# EAGLE schematic flipdot (EAGLE 7.7.0)
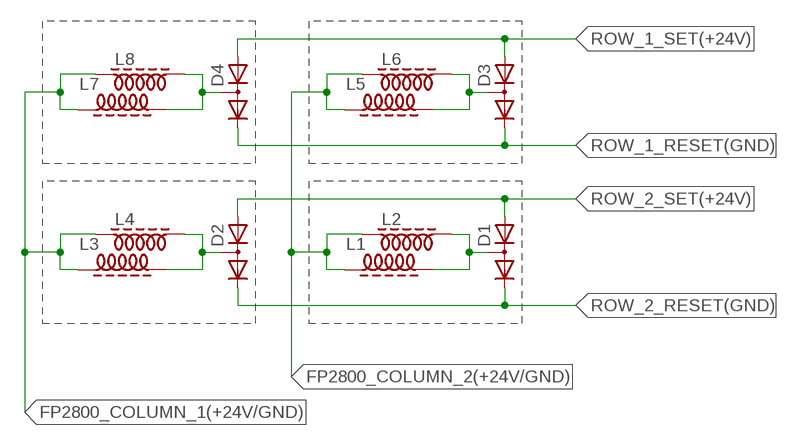
[diagram p0: schematic, sheet 1]

## Parts
D1  DIODE_2CACA-SOT23  [SOT23]
D2  DIODE_2CACA-SOT23  [SOT23]
D3  DIODE_2CACA-SOT23  [SOT23]
D4  DIODE_2CACA-SOT23  [SOT23]
L1  Z14/40CCW  [Z15/4]
L2  Z4/150CW  [Z4/15]
L3  Z14/40CCW  [Z15/4]
L4  Z4/150CW  [Z4/15]
L5  Z14/40CCW  [Z15/4]
L6  Z4/150CW  [Z4/15]
L7  Z14/40CCW  [Z15/4]
L8  Z4/150CW  [Z4/15]

## Nets
FP2800_COLUMN_1(+24V/GND): L3.1 L4.1 L7.1 L8.1
FP2800_COLUMN_2(+24V/GND): L1.1 L2.1 L5.1 L6.1
N$1: D1.3(AC) L1.2 L2.2
N$3: D2.3(AC) L3.2 L4.2
N$9: D3.3(AC) L5.2 L6.2
N$11: D4.3(AC) L7.2 L8.2
ROW_1_RESET(GND): D3.2(C) D4.2(C)
ROW_1_SET(+24V): D3.1(A) D4.1(A)
ROW_2_RESET(GND): D1.2(C) D2.2(C)
ROW_2_SET(+24V): D1.1(A) D2.1(A)

## Library data of the parts
D1-D4 = diode:DIODE_2CACA-: 2 Diodes - Cathode-Anode|Cathode-Anode
L1 L3 L5 L7 = inductor-neosid:Z?CCW: CHOKE free-suspension choke/nominal inductance winding counter clockwise; OC_FARNELL: unknown; OC_NEWARK: unknown
L2 L4 L6 L8 = inductor-neosid:Z?CW: CHOKE free-suspension choke/nominal inductance winding clockwise; OC_FARNELL: unknown; OC_NEWARK: unknown